# Altium schematic sheet RPi_header.SchDoc
size A4
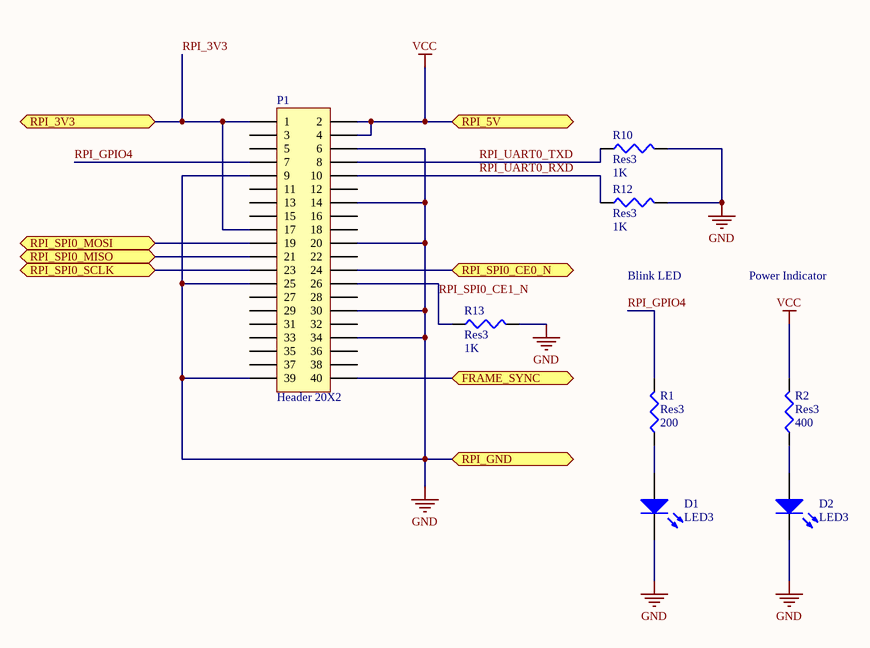
[diagram p0: RPi_header.SchDoc]

## Parts
D1  LED3  [3.5X2.8X1.9]
D2  LED3  [3.5X2.8X1.9]
P1  Header 20X2  [HDR2X20]
R1  Res3  value 200  [J1-0603]
R2  Res3  value 400  [J1-0603]
R10  Res3  value 1K  [J1-0603]
R12  Res3  value 1K  [J1-0603]
R13  Res3  value 1K  [J1-0603]

## Ports
FRAME_SYNC, RPI_3V3, RPI_5V, RPI_GND, RPI_SPI0_CE0_N, RPI_SPI0_MISO, RPI_SPI0_MOSI, RPI_SPI0_SCLK

## Nets
GND: D1.2(K) D2.2(K) P1.6 P1.9 P1.14 P1.20 P1.25 P1.30 P1.34 P1.39 R10.2 R12.2 R13.2 ; port RPI_GND
VCC: P1.2 P1.4 R2.2 ; port RPI_5V
FRAME_SYNC: P1.40 ; port FRAME_SYNC
RPI_3V3: P1.1 P1.17 ; port RPI_3V3
RPI_GPIO4: P1.7 R1.2
RPI_SPI0_CE0_N: P1.24 ; port RPI_SPI0_CE0_N
RPI_SPI0_CE1_N: P1.26 R13.1
RPI_SPI0_MISO: P1.21 ; port RPI_SPI0_MISO
RPI_SPI0_MOSI: P1.19 ; port RPI_SPI0_MOSI
RPI_SPI0_SCLK: P1.23 ; port RPI_SPI0_SCLK
RPI_UART0_RXD: P1.10 R12.1
RPI_UART0_TXD: P1.8 R10.1
NetD1_1: D1.1(A) R1.1
NetD2_1: D2.1(A) R2.1

Not connected (* = marked no-connect by the designer): P1 3 5 11 12 13 15 16 18 22 27 28 29 31 32 33 35 36 37 38

## Notes on the sheet
- Blink LED
- Power Indicator

## Library data of the parts
D1 D2 = LED3: Typical BLUE SiC LED; Published: 8-Jun-2000; LatestRevisionDate: 17-Dec-2003; LatestRevisionNote: PCB Footprint replaced.; DatasheetVersion: 16-Apr-2002; PackageVersion: 16-Apr-2002; PackageReference: 3.5X2.8X1.9; Publisher: Altium Limited; PackageDescription: SM LED; 2 C-Bend Leads; Body 3.5 x 2.8 x 1.9 mm, inc leads (LxWxH typ)
P1 = Header 20X2: Header, 20-Pin, Dual row; LatestRevisionDate: 17-Jul-2002; LatestRevisionNote: Re-released for DXP Platform.; Publisher: Altium Limited
R1 R2 R10 R12 R13 = Res3: Resistor; Published: 8-Jun-2000; LatestRevisionDate: 29-May-2009; LatestRevisionNote: IPC-7351 Footprint Added.; PackageReference: J1-0603; Publisher: Altium Limited; PackageDescription: Chip Resistor